# Altium schematic sheet ControlBoard.SchDoc
size A4; SheetNumber: 1; SheetTotal: 1
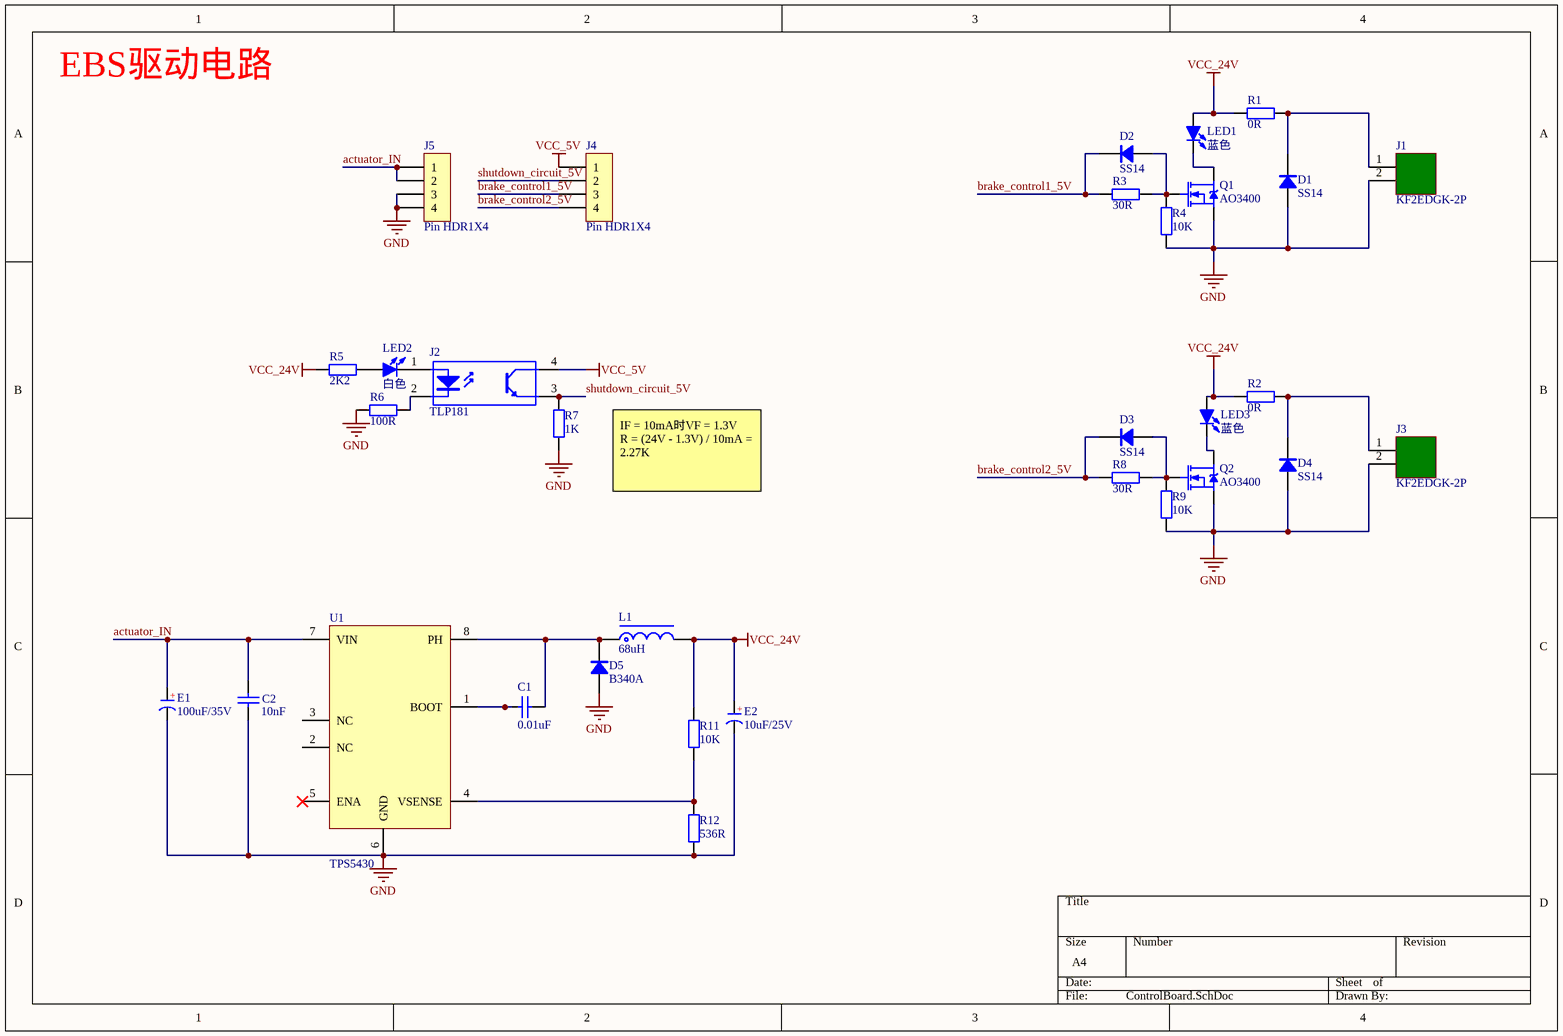
[diagram p0: ControlBoard.SchDoc]

## Parts
C1  0.01uF  [C 0805_M]
C2  10nF  [C 0805_M]
D1  SS14  [SMA]
D2  SS14  [SMA]
D3  SS14  [SMA]
D4  SS14  [SMA]
D5  B340A  [SMA]
E1  100uF/35V  [CM D(6.3*7.7)]
E2  10uF/25V  [CM C(5*5.4)]
J1  KF2EDGK-2P  [KF2EDGK5.08W-2P]
J2  TLP181  [SOP4]
J3  KF2EDGK-2P  [KF2EDGK5.08W-2P]
J4  Pin HDR1X4  [Pin HDR1X4/2.54mm-S]
J5  Pin HDR1X4  [Pin HDR1X4/2.54mm-S]
L1  68uH  [SMD,6.0*6.0]
LED1  蓝色  [LED 0805B]
LED2  白色  [LED 0805W]
LED3  蓝色  [LED 0805B]
Q1  AO3400  [SOT23]
Q2  AO3400  [SOT23]
R1  0R  [0805R]
R2  0R  [0805R]
R3  30R  [0805R]
R4  10K  [0805R]
R5  2K2  [0805R]
R6  100R  [0805R]
R7  1K  [0805R]
R8  30R  [0805R]
R9  10K  [0805R]
R11  10K  [0805R]
R12  536R  [0805R]
U1  TPS5430  [SOP8-Pad]

## Nets
GND: C2.2 D1.1(A) D4.1(A) D5.1(A) E1.2(K) E2.2(K) J1.2 J3.2 J5.3 J5.4 Q1.S Q2.S R4.2 R6.2 R7.2 R9.2 R12.1 U1.6(GND)
VCC_5V: J2.4(C) J4.1
VCC_24V: E2.1(A) L1.2 LED1.1(A) LED3.1(A) R1.2 R2.2 R5.2 R11.2
actuator_IN: C2.1 E1.1(A) J5.1 J5.2 U1.7(VIN)
brake_control1_5V: D2.2(K) J4.3 R3.2
brake_control2_5V: D3.2(K) J4.4 R8.2
shutdown_circuit_5V: J2.3(E) J4.2 R7.1
NetC1_1: C1.1 U1.1(BOOT)
NetC1_2: C1.2 D5.2(K) L1.1 U1.8(PH)
NetD1_2: D1.2(K) J1.1 R1.1
NetD2_1: D2.1(A) Q1.G R3.1 R4.1
NetD3_1: D3.1(A) Q2.G R8.1 R9.1
NetD4_2: D4.2(K) J3.1 R2.1
NetJ2_1: J2.1(A) LED2.2(K)
NetJ2_2: J2.2(K) R6.1
NetLED1_2: LED1.2(K) Q1.D
NetLED2_1: LED2.1(A) R5.1
NetLED3_2: LED3.2(K) Q2.D
NetR11_1: R11.1 R12.2 U1.4(VSENSE)

Not connected (* = marked no-connect by the designer): U1 2(NC) 3(NC) 5(ENA)*

## Notes on the sheet
- EBS驱动电路
- IF = 10mA时VF = 1.3V
  R = (24V - 1.3V) / 10mA = 2.27K
- (in symbol C-CM) +

## Library data of the parts
C1 C2 = C: 无极性贴片电容
D1-D4 = SS14: 肖特基二极管; 版权归属: 源创客; 属性: 40V/1A; BOM名称: 肖特基二极管; 学习资源: www.ooocke.com
D5 = SS34: 肖特基二极管 / 反向耐压大于28.5V; 版权归属: 源创客; 属性: 40V/3A; BOM名称: 肖特基二极管; 学习资源: www.ooocke.com
E1 = C-CM: 贴片电解电容 / ESR < 0.04R; 版权归属: 源创客; BOM名称: 贴片电解电容; 学习资源: www.ooocke.com
E2 = C-CM: 贴片电解电容 / ESR < 0.088R / V>24.0002V; 版权归属: 源创客; BOM名称: 贴片电解电容; 学习资源: www.ooocke.com
J2 = TLP181: 光耦; 版权归属: 源创客; BOM名称: 光耦; 学习资源: www.ooocke.com
L1 = L-CD: 贴片功率电感 / Irms>0.500003A / Ipk>0.563A; BOM名称: 功率电感; 版权归属: 源创客; 学习资源: www.ooocke.com
LED1-LED3 = LED-SMD: 贴片LED; 版权归属: 源创客; BOM名称: 贴片LED; 学习资源: www.ooocke.com
Q1 Q2 = N-MOS: N沟道场效应管
R1-R9 R11 R12 = RES: 贴片电阻
U1 = TPS5430: DCDC降压芯片